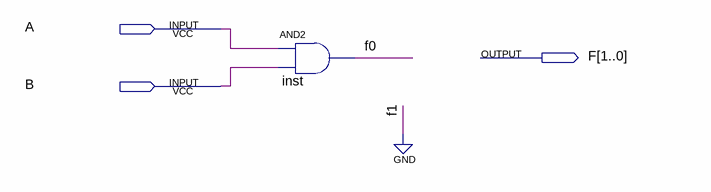
[diagram p0: schematic sheet]
// Quartus schematic MUL1.bdf as structural Verilog: 1 symbols, 3 pins
module MUL1 (
  input  A,
  input  B,
  output [1:0] F
);

  and inst (F[0], A, B);

  assign F[1] = 1'b0;
endmodule
